# EAGLE schematic 9AxisCombo (EAGLE 7.7.0)
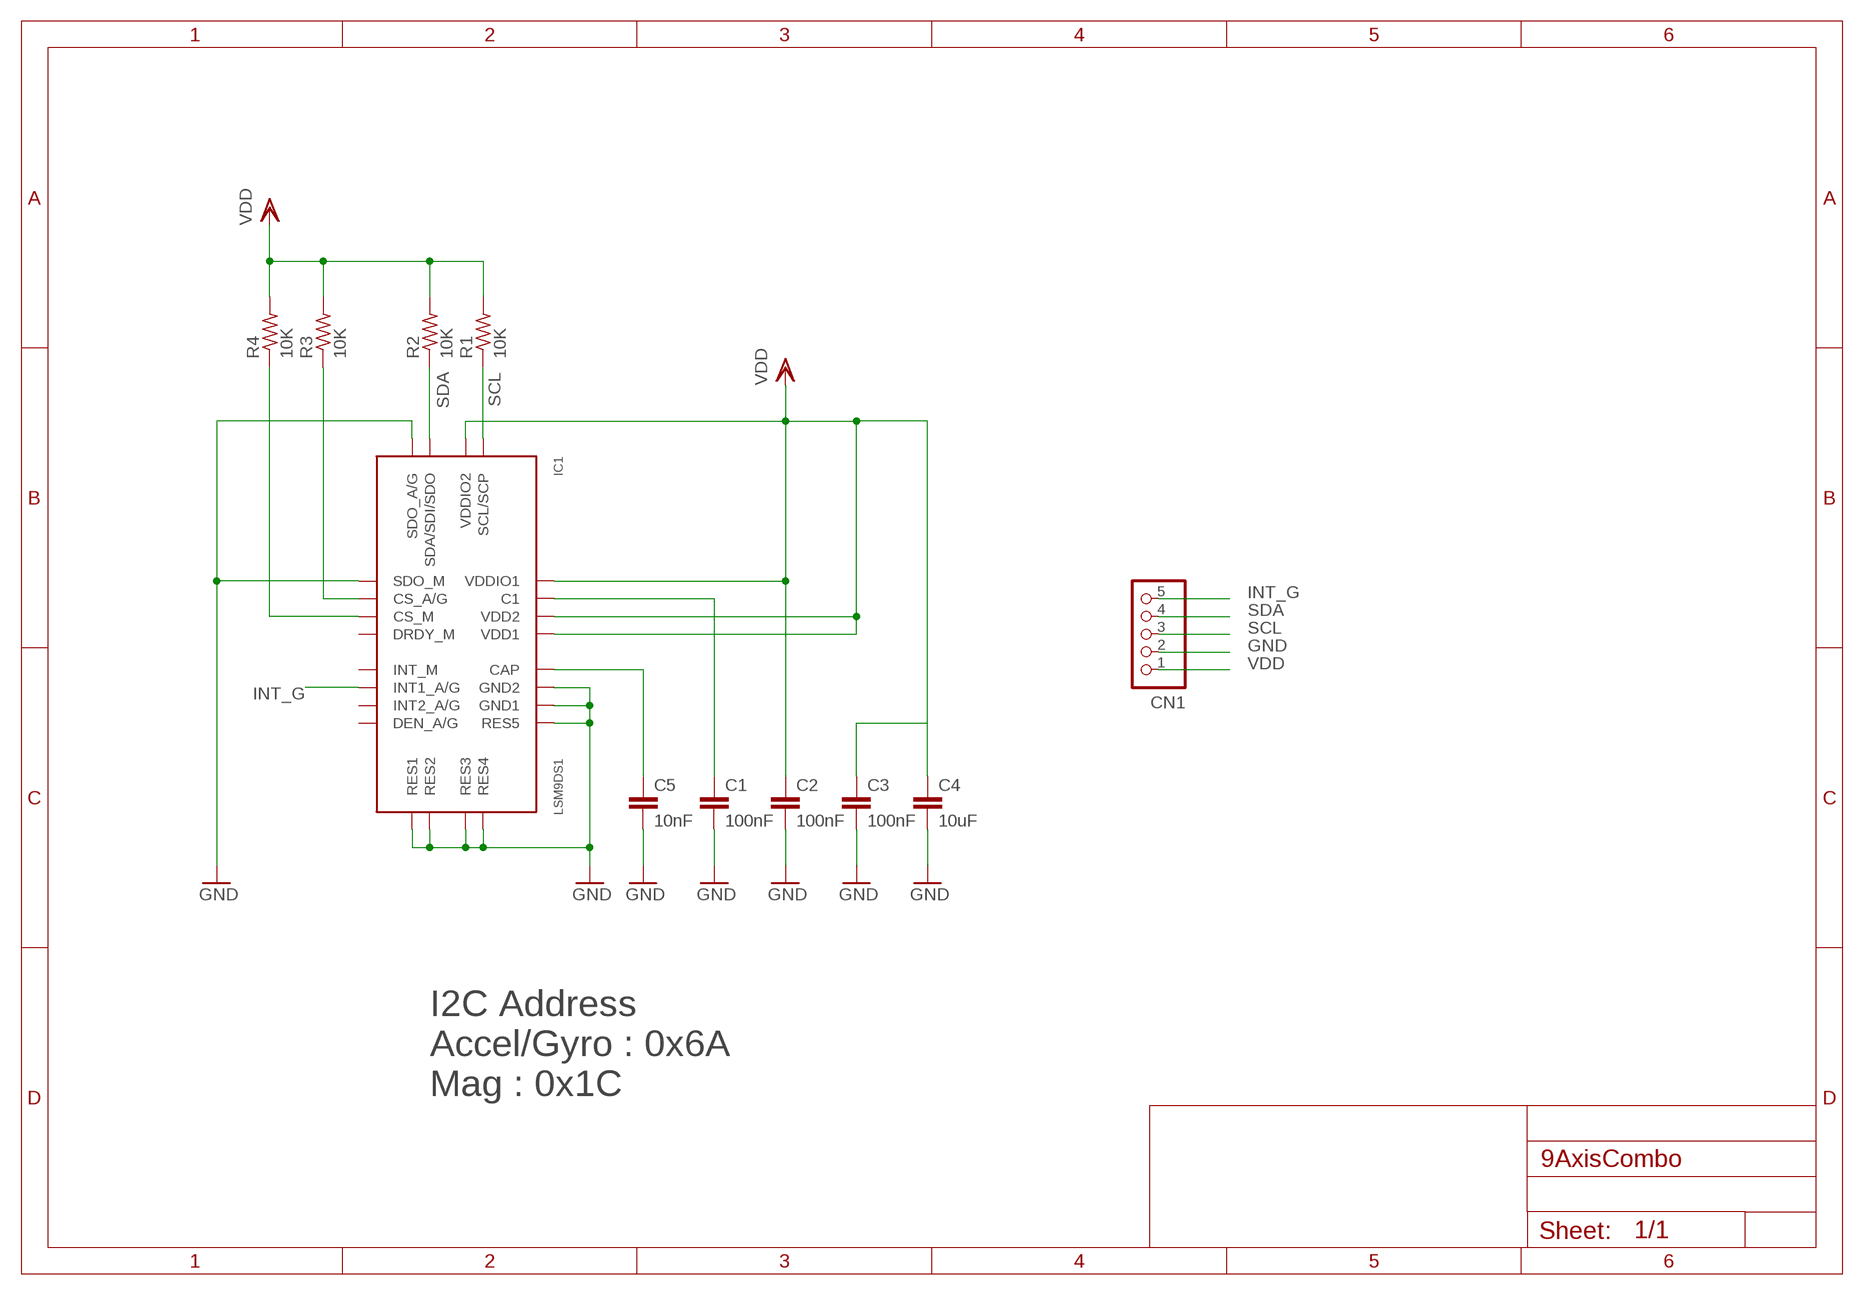
[diagram p0: schematic, sheet 1]

## Parts
C1  100nF  C-EUC0603  [C0603]
C2  100nF  C-EUC0603  [C0603]
C3  100nF  C-EUC0603  [C0603]
C4  10uF  C-EUC0603  [C0603]
C5  10nF  C-EUC0603  [C0603]
CN1  B5B-PH-K-S  [B5B-PH-K-S]
IC1  LSM9DS1  [LGA-24L]
R1  10K  R-US_R0603  [R0603]
R2  10K  R-US_R0603  [R0603]
R3  10K  R-US_R0603  [R0603]
R4  10K  R-US_R0603  [R0603]

## Nets
GND: C1.2 C2.2 C3.2 C4.2 C5.2 CN1.2 IC1.5(SDO_A/G) IC1.6(SDO_M) IC1.14(RES1) IC1.15(RES2) IC1.16(RES3) IC1.17(RES4) IC1.18(RES5) IC1.19(GND1) IC1.20(GND2)
INT_G: CN1.5 IC1.11(INT1_A/G)
N$1: C1.1 IC1.24(C1)
N$2: IC1.8(CS_M) R4.1
N$3: IC1.7(CS_A/G) R3.1
N$5: C3.1
N$7: C5.1 IC1.21(CAP)
SCL: CN1.3 IC1.2(SCL/SCP) R1.1
SDA: CN1.4 IC1.4(SDA/SDI/SDO) R2.1
VDD: C2.1 C4.1 CN1.1 IC1.1(VDDIO1) IC1.3(VDDIO2) IC1.22(VDD1) IC1.23(VDD2) R1.2 R2.2 R3.2 R4.2
Unconnected: IC1.9(DRDY_M) IC1.10(INT_M) IC1.12(INT2_A/G) IC1.13(DEN_A/G)

## Notes on the sheet
- I2C Address
  Accel/Gyro : 0x6A
  Mag : 0x1C

## Library data of the parts
C1-C5 = rcl:C-EU: CAPACITOR, European symbol
CN1 = jst-ph:B5B-PH-*: Wire-to-Board 2.0mm pitch top mount connector Source: http://www.jst-mfg.com/product/pdf/jpn/PH.pdf http://www.jst-mfg.com/product/detail.php?series=199
IC1 = st:LSM9DS1: Mouser 部品番号：511-LSM9DS1TR メーカ部品番号：LSM9DS1TR メーカ:STMicroelectronics 詳細：IMU - 慣性測定ユニット MOTION MEMS CONSUMER
R1-R4 = resistor:R-US_: RESISTOR, American symbol